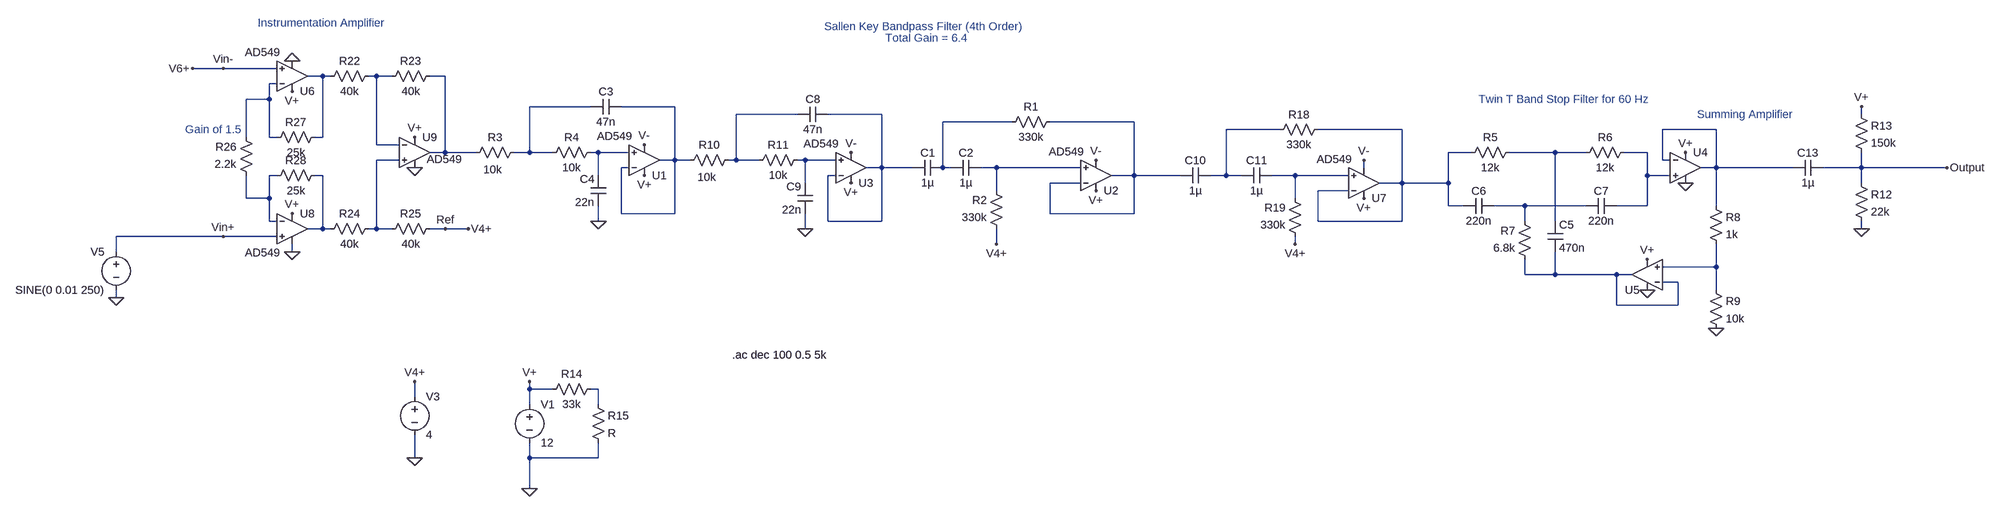
[diagram p0: schematic First_Iteration_EMG.asc]
First_Iteration_EMG.asc, the LTspice schematic file:
Version 4
SHEET 1 3528 964
WIRE -912 -64 -976 -64
WIRE -800 -64 -912 -64
WIRE -704 -48 -736 -48
WIRE -688 -48 -704 -48
WIRE -592 -48 -608 -48
WIRE -560 -48 -592 -48
WIRE -448 -48 -480 -48
WIRE -800 -32 -816 -32
WIRE -816 0 -816 -32
WIRE -816 0 -864 0
WIRE -144 16 -272 16
WIRE 32 16 -80 16
WIRE 288 32 160 32
WIRE 464 32 352 32
WIRE 2512 32 2512 16
WIRE 736 48 592 48
WIRE 992 48 816 48
WIRE 1296 64 1184 64
WIRE 1552 64 1376 64
WIRE 2208 64 2096 64
WIRE -864 80 -864 0
WIRE -816 80 -816 0
WIRE -800 80 -816 80
WIRE -704 80 -704 -48
WIRE -704 80 -720 80
WIRE -592 96 -592 -48
WIRE -544 96 -592 96
WIRE -448 112 -448 -48
WIRE -448 112 -480 112
WIRE -384 112 -448 112
WIRE -272 112 -272 16
WIRE -272 112 -304 112
WIRE -224 112 -272 112
WIRE -128 112 -144 112
WIRE -64 112 -128 112
WIRE 1696 112 1648 112
WIRE 1872 112 1776 112
WIRE 1936 112 1872 112
WIRE 2064 112 2016 112
WIRE -544 128 -592 128
WIRE 32 128 32 16
WIRE 32 128 0 128
WIRE 64 128 32 128
WIRE 160 128 160 32
WIRE 160 128 144 128
WIRE 208 128 160 128
WIRE 304 128 288 128
WIRE 368 128 304 128
WIRE 2096 128 2096 64
WIRE 2112 128 2096 128
WIRE -64 144 -80 144
WIRE 464 144 464 32
WIRE 464 144 432 144
WIRE 528 144 464 144
WIRE 592 144 592 48
WIRE 608 144 592 144
WIRE 704 144 672 144
WIRE 880 144 704 144
WIRE 1472 144 1472 128
WIRE 2208 144 2208 64
WIRE 2208 144 2176 144
WIRE 2368 144 2208 144
WIRE 2512 144 2512 112
WIRE 2512 144 2432 144
WIRE 2704 144 2512 144
WIRE -800 160 -816 160
WIRE -704 160 -720 160
WIRE -128 160 -128 112
WIRE 368 160 352 160
WIRE 992 160 992 48
WIRE 992 160 944 160
WIRE 1088 160 992 160
WIRE 1184 160 1184 64
WIRE 1184 160 1152 160
WIRE 1216 160 1184 160
WIRE 1328 160 1280 160
WIRE 1440 160 1328 160
WIRE 2064 160 2064 112
WIRE 2112 160 2064 160
WIRE 304 176 304 128
WIRE 880 176 816 176
WIRE 1552 176 1552 64
WIRE 1552 176 1504 176
WIRE 1648 176 1648 112
WIRE 1648 176 1552 176
WIRE 2512 176 2512 144
WIRE 704 192 704 144
WIRE 1440 192 1376 192
WIRE -864 208 -864 160
WIRE -816 208 -816 160
WIRE -816 208 -864 208
WIRE 1328 208 1328 160
WIRE 1648 224 1648 176
WIRE 1680 224 1648 224
WIRE 1808 224 1744 224
WIRE 1936 224 1808 224
WIRE 2064 224 2064 160
WIRE 2064 224 2000 224
WIRE 2208 224 2208 144
WIRE -80 240 -80 144
WIRE 32 240 32 128
WIRE 32 240 -80 240
WIRE 816 240 816 176
WIRE 992 240 992 160
WIRE 992 240 816 240
WIRE -816 256 -816 208
WIRE -800 256 -816 256
WIRE -128 256 -128 224
WIRE 352 256 352 160
WIRE 464 256 464 144
WIRE 464 256 352 256
WIRE 1376 256 1376 192
WIRE 1552 256 1552 176
WIRE 1552 256 1376 256
WIRE 1808 256 1808 224
WIRE 1872 256 1872 112
WIRE -704 272 -704 160
WIRE -704 272 -736 272
WIRE -688 272 -704 272
WIRE -592 272 -592 128
WIRE -592 272 -608 272
WIRE -560 272 -592 272
WIRE -448 272 -480 272
WIRE -400 272 -448 272
WIRE 304 272 304 240
WIRE 2512 272 2512 256
WIRE -912 288 -1136 288
WIRE -800 288 -912 288
WIRE 704 304 704 272
WIRE 1328 304 1328 288
WIRE -1136 320 -1136 288
WIRE -768 320 -768 304
WIRE 2208 352 2208 304
WIRE 2208 352 2096 352
WIRE 1808 368 1808 336
WIRE 1872 368 1872 320
WIRE 1872 368 1808 368
WIRE 2000 368 1872 368
WIRE 2032 368 2000 368
WIRE 2128 384 2096 384
WIRE 2208 400 2208 352
WIRE -1136 416 -1136 400
WIRE 2000 432 2000 368
WIRE 2128 432 2128 384
WIRE 2128 432 2000 432
WIRE -272 608 -272 592
WIRE -224 608 -272 608
WIRE -128 608 -144 608
WIRE -512 624 -512 592
WIRE -272 640 -272 608
WIRE -128 640 -128 608
WIRE -512 752 -512 704
WIRE -272 752 -272 720
WIRE -128 752 -128 720
WIRE -128 752 -272 752
WIRE -272 816 -272 752
FLAG 2208 480 0
FLAG -272 816 0
FLAG -272 592 V+
FLAG 912 192 V+
FLAG -32 160 V+
FLAG 2064 336 V+
FLAG 2144 112 V+
FLAG 1472 208 V+
FLAG -912 -64 Vin-
FLAG -448 272 Ref
FLAG -912 288 Vin+
FLAG -1136 416 0
FLAG -768 -80 0
FLAG -512 144 0
FLAG -512 80 V+
FLAG -768 240 V+
FLAG -768 -16 V+
FLAG -768 320 0
FLAG -400 272 V4+
FLAG -976 -64 V6+
FLAG -512 592 V4+
FLAG -512 752 0
FLAG -128 256 0
FLAG 1472 128 V-
FLAG 912 128 V-
FLAG -32 96 V-
FLAG 400 176 V+
FLAG 304 272 0
FLAG 400 112 V-
FLAG 704 304 V4+
FLAG 1328 304 V4+
FLAG 2144 176 0
FLAG 2064 400 0
FLAG 2512 272 0
FLAG 2512 16 V+
FLAG 2704 144 Output
SYMBOL cap 592 128 R90
WINDOW 0 0 32 VBottom 2
WINDOW 3 32 32 VTop 2
SYMATTR InstName C1
SYMATTR Value 1µ
SYMBOL cap 672 128 R90
WINDOW 0 0 32 VBottom 2
WINDOW 3 32 32 VTop 2
SYMATTR InstName C2
SYMATTR Value 1µ
SYMBOL res 832 32 R90
WINDOW 0 0 56 VBottom 2
WINDOW 3 32 56 VTop 2
SYMATTR InstName R1
SYMATTR Value 330k
SYMBOL res 720 288 R180
WINDOW 0 36 76 Left 2
WINDOW 3 36 40 Left 2
SYMATTR InstName R2
SYMATTR Value 330k
SYMBOL res -288 96 R90
WINDOW 0 0 56 VBottom 2
WINDOW 3 36 61 VTop 2
SYMATTR InstName R3
SYMATTR Value 10k
SYMBOL res -128 96 R90
WINDOW 0 0 56 VBottom 2
WINDOW 3 32 56 VTop 2
SYMATTR InstName R4
SYMATTR Value 10k
SYMBOL cap -80 0 R90
WINDOW 0 0 32 VBottom 2
WINDOW 3 32 32 VTop 2
SYMATTR InstName C3
SYMATTR Value 47n
SYMBOL cap -112 224 R180
WINDOW 0 24 56 Left 2
WINDOW 3 24 8 Left 2
SYMATTR InstName C4
SYMATTR Value 22n
SYMBOL res 1792 96 R90
WINDOW 0 0 56 VBottom 2
WINDOW 3 32 56 VTop 2
SYMATTR InstName R5
SYMATTR Value 12k
SYMBOL res 2032 96 R90
WINDOW 0 0 56 VBottom 2
WINDOW 3 32 56 VTop 2
SYMATTR InstName R6
SYMATTR Value 12k
SYMBOL res 1824 352 R180
WINDOW 0 36 76 Left 2
WINDOW 3 36 40 Left 2
SYMATTR InstName R7
SYMATTR Value 6.8k
SYMBOL cap 1856 256 R0
SYMATTR InstName C5
SYMATTR Value 470n
SYMBOL cap 1744 208 R90
WINDOW 0 0 32 VBottom 2
WINDOW 3 32 32 VTop 2
SYMATTR InstName C6
SYMATTR Value 220n
SYMBOL cap 2000 208 R90
WINDOW 0 0 32 VBottom 2
WINDOW 3 32 32 VTop 2
SYMATTR InstName C7
SYMATTR Value 220n
SYMBOL OpAmps\\UniversalOpAmp 2144 144 R0
SYMATTR InstName U4
SYMBOL OpAmps\\UniversalOpAmp 2064 368 R180
SYMATTR InstName U5
SYMBOL res 2192 208 R0
SYMATTR InstName R8
SYMATTR Value 1k
SYMBOL res 2192 384 R0
SYMATTR InstName R9
SYMATTR Value 10k
SYMBOL voltage -272 624 R0
SYMATTR InstName V1
SYMATTR Value 12
SYMBOL OpAmps\\AD549 912 224 M180
WINDOW 3 -99 114 Left 2
SYMATTR InstName U2
SYMBOL OpAmps\\AD549 -32 192 M180
WINDOW 3 -99 114 Left 2
SYMATTR InstName U1
SYMBOL cap 1152 144 R90
WINDOW 0 0 32 VBottom 2
WINDOW 3 32 32 VTop 2
SYMATTR InstName C10
SYMATTR Value 1µ
SYMBOL cap 1280 144 R90
WINDOW 0 0 32 VBottom 2
WINDOW 3 32 32 VTop 2
SYMATTR InstName C11
SYMATTR Value 1µ
SYMBOL res 1392 48 R90
WINDOW 0 0 56 VBottom 2
WINDOW 3 32 56 VTop 2
SYMATTR InstName R18
SYMATTR Value 330k
SYMBOL res 1344 304 R180
WINDOW 0 36 76 Left 2
WINDOW 3 36 40 Left 2
SYMATTR InstName R19
SYMATTR Value 330k
SYMBOL OpAmps\\AD549 1472 240 M180
WINDOW 3 -99 114 Left 2
SYMATTR InstName U7
SYMBOL OpAmps\\AD549 -768 16 M180
WINDOW 3 -99 114 Left 2
SYMATTR InstName U6
SYMBOL OpAmps\\AD549 -768 208 R0
WINDOW 3 -99 114 Left 2
SYMATTR InstName U8
SYMBOL OpAmps\\AD549 -512 48 R0
WINDOW 3 25 78 Left 2
SYMATTR InstName U9
SYMBOL res -592 -64 R90
WINDOW 0 0 56 VBottom 2
WINDOW 3 32 56 VTop 2
SYMATTR InstName R22
SYMATTR Value 40k
SYMBOL res -464 -64 R90
WINDOW 0 0 56 VBottom 2
WINDOW 3 32 56 VTop 2
SYMATTR InstName R23
SYMATTR Value 40k
SYMBOL res -592 256 R90
WINDOW 0 0 56 VBottom 2
WINDOW 3 32 56 VTop 2
SYMATTR InstName R24
SYMATTR Value 40k
SYMBOL res -464 256 R90
WINDOW 0 0 56 VBottom 2
WINDOW 3 32 56 VTop 2
SYMATTR InstName R25
SYMATTR Value 40k
SYMBOL res -848 176 R180
WINDOW 0 36 76 Left 2
WINDOW 3 36 40 Left 2
SYMATTR InstName R26
SYMATTR Value 2.2k
SYMBOL res -704 64 R90
WINDOW 0 0 56 VBottom 2
WINDOW 3 32 56 VTop 2
SYMATTR InstName R27
SYMATTR Value 25k
SYMBOL res -704 144 R90
WINDOW 0 0 56 VBottom 2
WINDOW 3 32 56 VTop 2
SYMATTR InstName R28
SYMATTR Value 25k
SYMBOL voltage -1136 304 M0
WINDOW 123 0 0 Left 0
WINDOW 39 0 0 Left 0
SYMATTR InstName V5
SYMATTR Value SINE(0 0.01 250)
SYMBOL voltage -512 608 R0
SYMATTR InstName V3
SYMATTR Value 4
SYMBOL res 160 112 R90
WINDOW 0 0 56 VBottom 2
WINDOW 3 36 61 VTop 2
SYMATTR InstName R10
SYMATTR Value 10k
SYMBOL res 304 112 R90
WINDOW 0 0 56 VBottom 2
WINDOW 3 32 56 VTop 2
SYMATTR InstName R11
SYMATTR Value 10k
SYMBOL cap 352 16 R90
WINDOW 0 0 32 VBottom 2
WINDOW 3 32 32 VTop 2
SYMATTR InstName C8
SYMATTR Value 47n
SYMBOL cap 320 240 R180
WINDOW 0 24 56 Left 2
WINDOW 3 24 8 Left 2
SYMATTR InstName C9
SYMATTR Value 22n
SYMBOL OpAmps\\AD549 400 208 M180
WINDOW 3 -99 114 Left 2
SYMATTR InstName U3
SYMBOL cap 2432 128 R90
WINDOW 0 0 32 VBottom 2
WINDOW 3 32 32 VTop 2
SYMATTR InstName C13
SYMATTR Value 1µ
SYMBOL res 2496 16 R0
SYMATTR InstName R13
SYMATTR Value 150k
SYMBOL res 2496 160 R0
SYMATTR InstName R12
SYMATTR Value 22k
SYMBOL res -128 592 R90
WINDOW 0 0 56 VBottom 2
WINDOW 3 32 56 VTop 2
SYMATTR InstName R14
SYMATTR Value 33k
SYMBOL res -144 624 R0
SYMATTR InstName R15
TEXT 344 -152 Left 2 ;Sallen Key Bandpass Filter (4th Order)
TEXT 1712 0 Left 2 ;Twin T Band Stop Filter for 60 Hz
TEXT -840 -160 Left 2 ;Instrumentation Amplifier
TEXT 2168 32 Left 2 ;Summing Amplifier
TEXT -992 64 Left 2 ;Gain of 1.5
TEXT 472 -128 Left 2 ;Total Gain = 6.4
TEXT 152 536 Left 2 !.ac dec 100 0.5 5k

The netlist it stands for:
* First_Iteration_EMG.asc
C1 N009 N008 1µ
C2 N019 N009 1µ
R1 N010 N009 330k
R2 V4+ N019 330k
R3 N005 N003 10k
R4 N014 N005 10k
C3 N006 N005 47n
C4 0 N014 22n
R5 N015 N012 12k
R6 N016 N015 12k
R7 N025 N023 6.8k
C5 N015 N025 470n
C6 N023 N012 220n
C7 N016 N023 220n
XU4 N016 N013 V+ 0 N013 level1 Avol=1Meg GBW=10Meg Vos=0 En=0 Enk=0 In=0 Ink=0 Rin=500Meg  ; pins In+ In- V+ V- OUT
XU5 N024 N025 0 V+ N025 level1 Avol=1Meg GBW=10Meg Vos=0 En=0 Enk=0 In=0 Ink=0 Rin=500Meg  ; pins In+ In- V+ V- OUT
R8 N013 N024 1k
R9 N024 0 10k
V1 V+ 0 12
XU2 N019 N010 V+ V- N010 AD549  ; pins In+ In- V+ V- OUT
XU1 N014 N006 V+ V- N006 AD549  ; pins In+ In- V+ V- OUT
C10 N011 N010 1µ
C11 N022 N011 1µ
R18 N012 N011 330k
R19 V4+ N022 330k
XU7 N022 N012 V+ V- N012 AD549  ; pins In+ In- V+ V- OUT
XU6 V6+ N004 V+ 0 N001 AD549  ; pins In+ In- V+ V- OUT
XU8 Vin+ N020 V+ 0 N021 AD549  ; pins In+ In- V+ V- OUT
XU9 N017 N002 V+ 0 N003 AD549  ; pins In+ In- V+ V- OUT
R22 N002 N001 40k
R23 N003 N002 40k
R24 N017 N021 40k
R25 V4+ N017 40k
R26 N020 N004 2.2k
R27 N001 N004 25k
R28 N021 N020 25k
V5 Vin+ 0 SINE(0 0.01 250)
V3 V4+ 0 4
R10 N007 N006 10k
R11 N018 N007 10k
C8 N008 N007 47n
C9 0 N018 22n
XU3 N018 N008 V+ V- N008 AD549  ; pins In+ In- V+ V- OUT
C13 Output N013 1µ
R13 V+ Output 150k
R12 Output 0 22k
R14 N026 V+ 33k
R15 N026 0 R
* Sallen Key Bandpass Filter (4th Order)
* Twin T Band Stop Filter for 60 Hz
* Instrumentation Amplifier
* Summing Amplifier
* Gain of 1.5
* Total Gain = 6.4
.ac dec 100 0.5 5k
.lib UniversalOpAmp1.lib
.backanno
.end